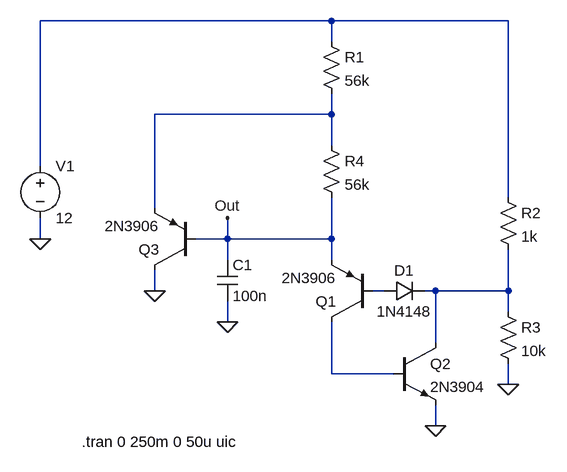
[diagram p0: schematic BootstrappedChargingResistor.asc]
BootstrappedChargingResistor.asc, the LTspice schematic file:
Version 4
SHEET 1 880 680
WIRE 128 -240 -320 -240
WIRE 400 -240 128 -240
WIRE 128 -208 128 -240
WIRE 128 -96 128 -128
WIRE 128 -96 -144 -96
WIRE 128 -48 128 -96
WIRE -320 -16 -320 -240
WIRE 400 32 400 -240
WIRE -144 48 -144 -96
WIRE -320 96 -320 64
WIRE -32 96 -32 64
WIRE -32 96 -80 96
WIRE 128 96 128 32
WIRE 128 96 -32 96
WIRE -32 128 -32 96
WIRE 128 128 128 96
WIRE -144 176 -144 144
WIRE 208 176 192 176
WIRE 288 176 272 176
WIRE 400 176 400 112
WIRE 400 176 288 176
WIRE 400 208 400 176
WIRE -32 224 -32 192
WIRE 288 256 288 176
WIRE 128 304 128 224
WIRE 224 304 128 304
WIRE 400 320 400 288
WIRE 288 384 288 352
FLAG 288 384 0
FLAG -32 224 0
FLAG -320 96 0
FLAG 400 320 0
FLAG -32 64 Out
FLAG -144 176 0
SYMBOL pnp 192 224 R180
SYMATTR InstName Q1
SYMATTR Value 2N3906
SYMBOL npn 224 256 R0
SYMATTR InstName Q2
SYMATTR Value 2N3904
SYMBOL res 112 -224 R0
SYMATTR InstName R1
SYMATTR Value 56k
SYMBOL cap -48 128 R0
SYMATTR InstName C1
SYMATTR Value 100n
SYMBOL voltage -320 -32 R0
WINDOW 123 0 0 Left 0
WINDOW 39 0 0 Left 0
SYMATTR InstName V1
SYMATTR Value 12
SYMBOL res 384 16 R0
SYMATTR InstName R2
SYMATTR Value 1k
SYMBOL res 384 192 R0
SYMATTR InstName R3
SYMATTR Value 10k
SYMBOL res 112 -64 R0
SYMATTR InstName R4
SYMATTR Value 56k
SYMBOL pnp -80 144 R180
SYMATTR InstName Q3
SYMATTR Value 2N3906
SYMBOL diode 208 192 R270
WINDOW 0 32 32 VTop 0
WINDOW 3 0 32 VBottom 0
SYMATTR InstName D1
SYMATTR Value 1N4148
TEXT -256 408 Left 0 !.tran 0 250m 0 50u uic

The netlist it stands for:
* BootstrappedChargingResistor.asc
Q1 N005 N003 Out 0 2N3906
Q2 N004 N005 0 0 2N3904
R1 N001 N002 56k
C1 Out 0 100n
V1 N001 0 12
R2 N001 N004 1k
R3 N004 0 10k
R4 N002 Out 56k
Q3 0 Out N002 0 2N3906
D1 N003 N004 1N4148
.model D D
.lib standard.dio
.model NPN NPN
.model PNP PNP
.lib standard.bjt
.tran 0 250m 0 50u uic
.backanno
.end